# Altium schematic sheet LCD.SchDoc
size A4
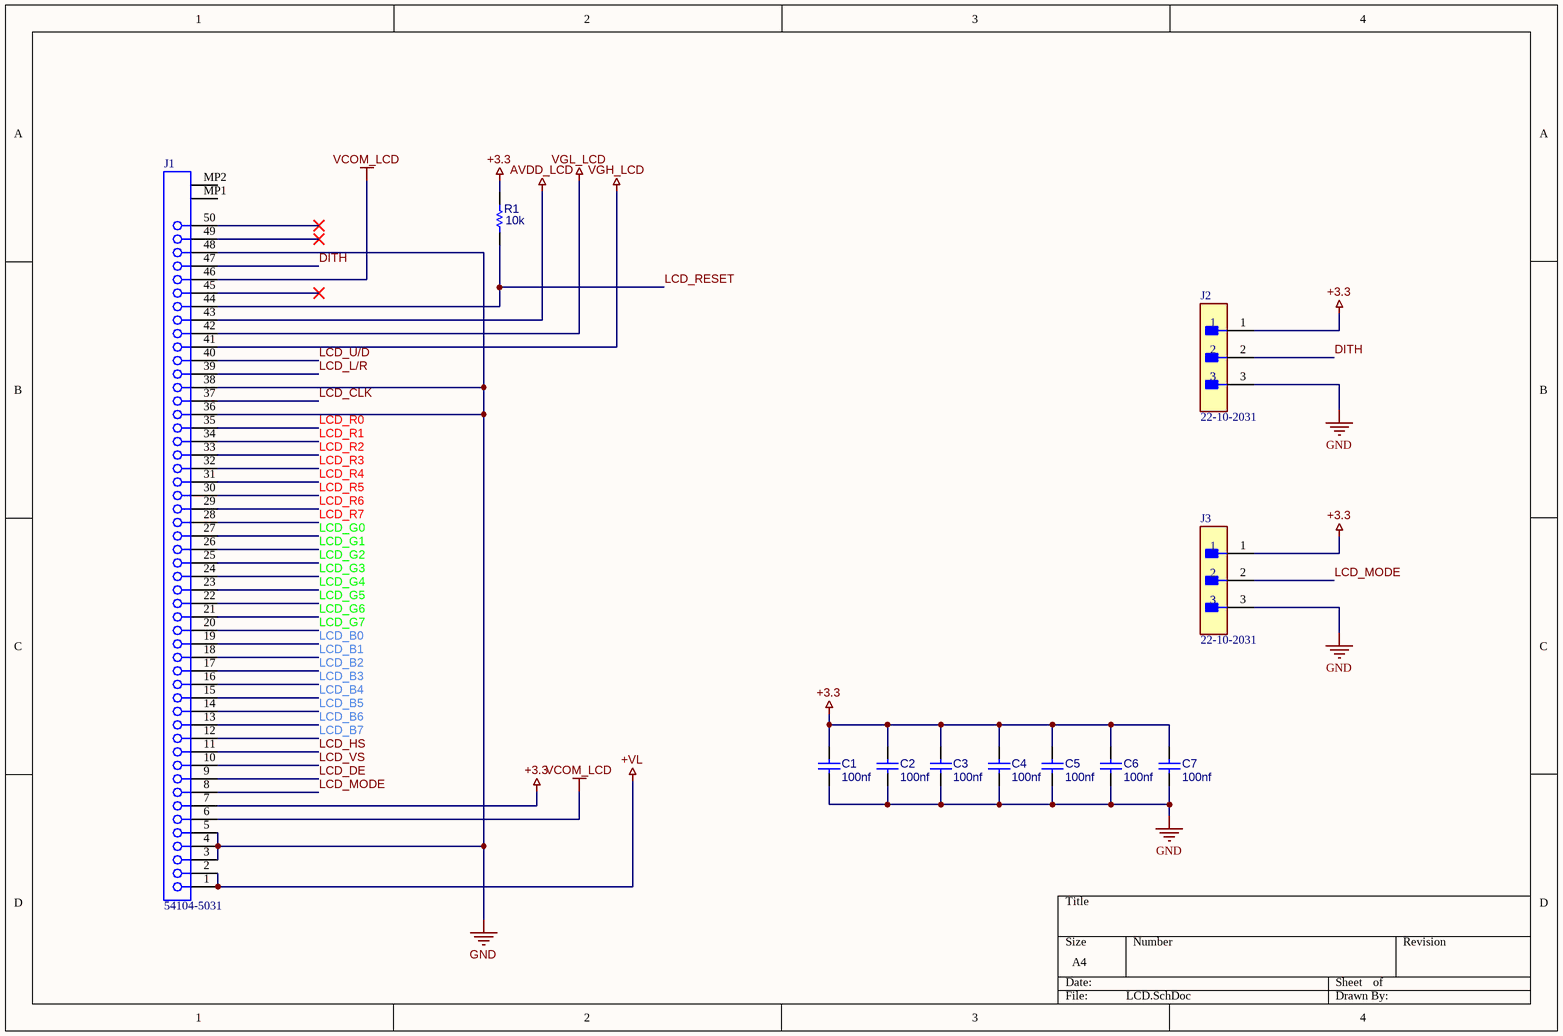
[diagram p0: LCD.SchDoc]

## Parts
C1  100nf  [CAPC2013X70X45NL10T25]
C2  100nf  [CAPC2013X70X45NL10T25]
C3  100nf  [CAPC2013X70X45NL10T25]
C4  100nf  [CAPC2013X70X45NL10T25]
C5  100nf  [CAPC2013X70X45NL10T25]
C6  100nf  [CAPC2013X70X45NL10T25]
C7  100nf  [CAPC2013X70X45NL10T25]
J1  54104-5031  [MOLX-54104-5031]
J2  22-10-2031  [FP-22-10-2031-MFG]
J3  22-10-2031  [FP-22-10-2031-MFG]
R1  10k  [RESC2013X60X35ML10T20]

## Nets
+3.3: C1.2 C2.2 C3.2 C4.2 C5.2 C6.2 C7.2 J1.7 J2.1 J3.1 R1.1
+VL: J1.1 J1.2
AVDD_LCD: J1.43
GND: C1.1 C2.1 C3.1 C4.1 C5.1 C6.1 C7.1 J1.3 J1.4 J1.5 J1.36 J1.38 J1.48 J2.3 J3.3
VCOM_LCD: J1.6 J1.46
VGH_LCD: J1.41
VGL_LCD: J1.42
DITH: J1.47 J2.2
LCD_B0: J1.19
LCD_B1: J1.18
LCD_B2: J1.17
LCD_B3: J1.16
LCD_B4: J1.15
LCD_B5: J1.14
LCD_B6: J1.13
LCD_B7: J1.12
LCD_CLK: J1.37
LCD_DE: J1.9
LCD_G0: J1.27
LCD_G1: J1.26
LCD_G2: J1.25
LCD_G3: J1.24
LCD_G4: J1.23
LCD_G5: J1.22
LCD_G6: J1.21
LCD_G7: J1.20
LCD_HS: J1.11
LCD_L/R: J1.39
LCD_MODE: J1.8 J3.2
LCD_R0: J1.35
LCD_R1: J1.34
LCD_R2: J1.33
LCD_R3: J1.32
LCD_R4: J1.31
LCD_R5: J1.30
LCD_R6: J1.29
LCD_R7: J1.28
LCD_RESET: J1.44 R1.2
LCD_U/D: J1.40
LCD_VS: J1.10

Not connected (* = marked no-connect by the designer): J1 45* 49* 50* MP1 MP2

## Library data of the parts
C1-C7 = CMP-2007-00957-1: Part Number: GRM216R61E105KA12D; Manufacturer: Murata
J1 = CMP-1241-00514-1: 0.5 mm Pitch Easy-On(TM) Type FPC Connector, 2.0 mm Mated Height, Right Angle, ZIF, SMT, Top Contact, 50 Circuits, -20 to 85 degC, ELV and RoHS Compliant, Tape and Reel; Manufacturer: Molex; Voltage (Max): 50V; Stackable: No; Pitch - Mating Interface: 0.50mm; Current (Max per Contact): 0.5A; Polarized to PCB: Yes; Mated Height: 2.00mm; Material - Metal: Phosphor Bronze; Durability (mating cycles max): 20; Circuits (Loaded): 50; Entry Angle: 90degrees Angle; ComponentLink3URL: http://www.molex.com/pdm_docs/sd/541045031_sd.pdf; Packing: Tape and Reel; ComponentLink2URL: http://www.molex.com/webdocs/datasheets/pdf/en-us/0541045031_FFC_FPC_CONNECTORS.pdf; Contact Position: Top; Number of Rows: 1; ComponentLink3Description: Package Specification; PackageDescription: 50-Lead FPC Connector, Pitch 0.5 mm; PackageVersion: Rev. F, 06/2012; PartNumber: 54104-5031; ComponentLink2Description: Datasheet; PCB Locator: No; PackageReference: 54104-5031; PCB Retention: Yes; ComponentLink1Description: Manufacturer URL; ComponentLink1URL: http://www.molex.com/molex/index.jsp; RoHS: TRUE; Orientation: Right Angle; Mounting Technology: Surface Mount
J2 J3 = CMP-04776-000653-1: CONN HEADER VERT 3POS 2.54MM; Insulation Resistance: 50GR; Glow Wire Compliant: Non-compliant; Number of Contacts: 3; Max Current Rating: 4A; Voltage Rating (DC): 250V; Gender: Male; Contact Resistance: 10mR; Approvals: UL; Color: White; Radiation Hardening: No; Pitch: 2.54mm; Packaging: Bulk; Orientation: Straight; Housing Material: Nylon; Depth: 2.34mm; Flammability Rating: UL94 V-0; Number of Circuits: 3; Min Operating Temperature: 0°C; Lead Free: Lead Free; Contact Plating: Gold; Halogen Free: Low Halogen; Max Voltage Rating (AC): 250V; Length: 7.37mm; Height: 10.79mm; Current Rating: 4A; Series: KK® 4030; Contact Material: Brass; Number of Rows: 1; Housing Color: White; Voltage Rating: 250V; Package Quantity: 2000; Number of Positions: 3; Contact Type: Male Pin; Mount: Through Hole; Max Operating Temperature: 75°C; Termination: Solder; Contact Mating Length: 0.295inch
R1 = CMP-2100-03671-1: Chip Resistor, 1 KOhm, +/- 1%, 125 mW, -55 to 155 degC, 0805 (2012 Metric), RoHS, Tape and Reel; Manufacturer: Yageo; Temperature Coefficient: 100ppm/degreesC; Voltage Rating (DC): 150V; Max Power Dissipation: 125mW; Resistance: 1KOhm; Number of Pins: 2; Number of Terminations: 2; Datasheet URL: http://www.yageo.com/NewPortal/yageodocoutput?fileName=/pdf/R-Chip/PYu-RC_Group_51_RoHS_L_5.pdf; Length: 0.079inch; Package Description: 2-Pin Surface Mounted Device, Body 2 x 1.25 mm; Depth: 1.25mm; Height: 0.024inch; Military Standard: Not; Case/Package: 0805; Package Reference: 0805; RoHSCompliant: true; Lead Free: LeadFree; Packaging: TapeandReel; Package Quantity: 1; Datasheet Version: Rev. 5, 10/2016; Tolerance: 1%; Min Operating Temperature: -55degC; Voltage Rating: 150V; Composition: ThickFilm; Case Code (Imperial): 0805; Power Rating: 125mW; Width: 0.049inch; Case Code (Metric): 2012; Manufacturer URL: http://www.yageo.com/; Max Operating Temperature: 155degC; REACH SVHC: Unknown; Termination: SMD/SMT